# EAGLE design sparkfun-micromod-notecarrier (EAGLE 9.6.2)
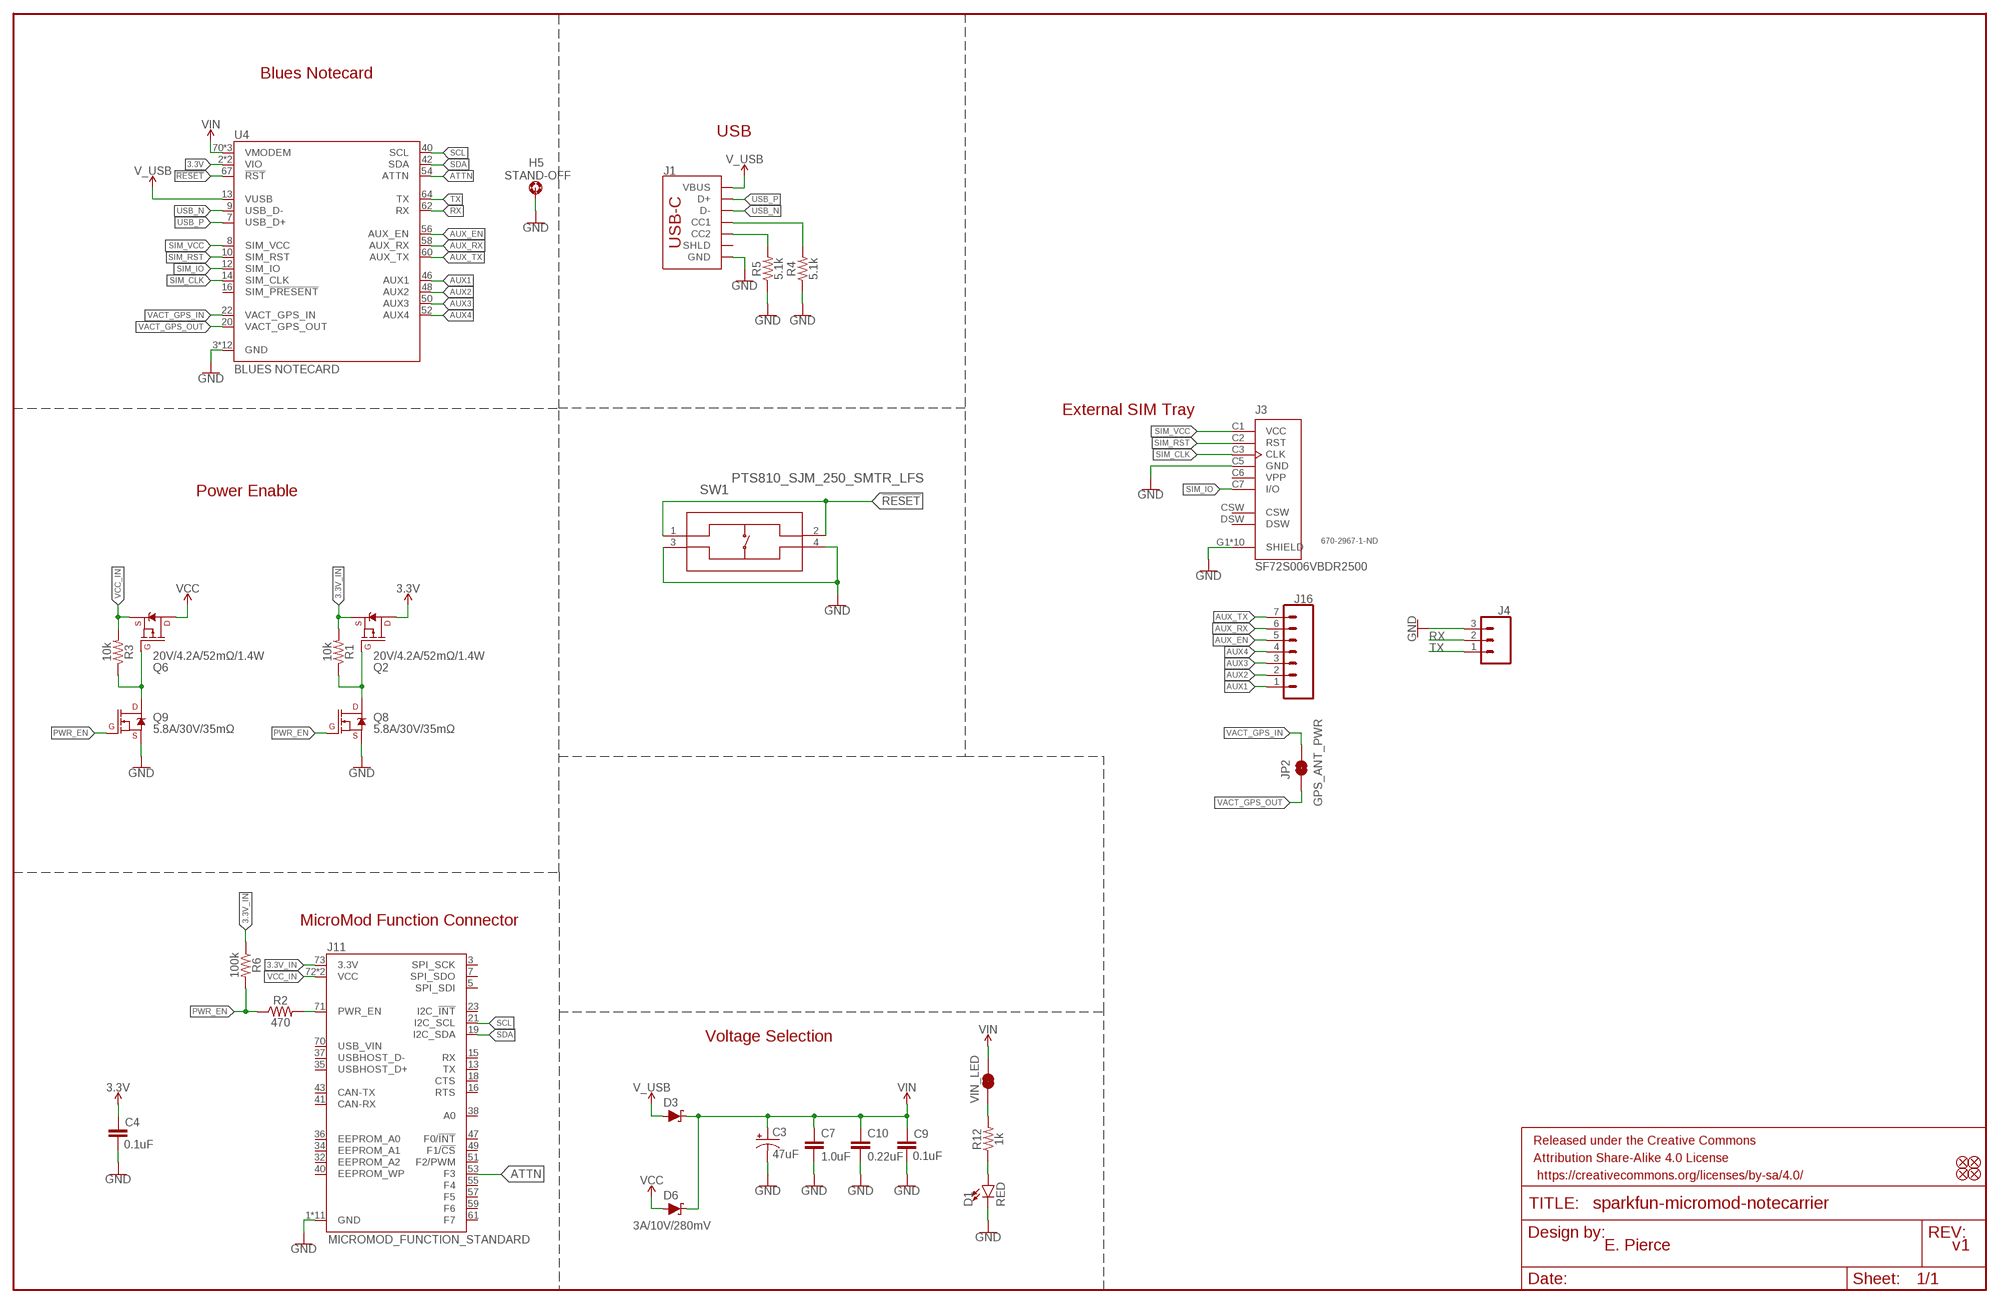
[diagram p0: schematic, sheet 1]

## Parts
C3  47uF  47UF-POLAR-EIA3528-10V-10%  [EIA3528]
C4  0.1uF  0.1UF-0603-25V-(+80/-20%)  [0603]
C7  1.0uF  1.0UF-0603-16V-10%  [0603]
C9  0.1uF  0.1UF-0603-25V-(+80/-20%)  [0603]
C10  0.22uF  0.22UF-0603-25V-10%  [0603]
D1  RED  LED-RED0603  [LED-0603]
D3  3A/10V/280mV  DIODE-SCHOTTKY-BAT60A  [SOD-323]
D6  3A/10V/280mV  DIODE-SCHOTTKY-BAT60A  [SOD-323]
FD1  FIDUCIALUFIDUCIAL  [FIDUCIAL-MICRO]
FD2  FIDUCIALUFIDUCIAL  [FIDUCIAL-MICRO]
FD3  FIDUCIALUFIDUCIAL  [FIDUCIAL-MICRO]
FD4  FIDUCIALUFIDUCIAL  [FIDUCIAL-MICRO]
FRAME1  FRAME-LEDGER  [CREATIVE_COMMONS]
H5  STAND-OFF  STAND-OFF-REFLOW2.5MM_TALL  [STAND-OFF-REFLOW-M2.5]
J1  USB_C_2-LAYER_PADS  [USB-C-16P-2LAYER-PADS]
J3  SF72S006VBDR2500  [JAE_SF72S006VBDR2500]
J4  CONN_031X03_NO_SILK  [1X03_NO_SILK]
J11  MICROMOD_FUNCTION_STANDARD  [M.2-CARD-E-22_FUNCTION_STANDARD]
J16  CONN_07NO_SILK  [1X07_NO_SILK]
JP2  GPS_ANT_PWR  JUMPER-SMT_2_NO_SILK  [SMT-JUMPER_2_NO_SILK]
Q2  20V/4.2A/52mΩ/1.4W  MOSFET_PCH-DMG2305UX-7  [SOT23-3]
Q6  20V/4.2A/52mΩ/1.4W  MOSFET_PCH-DMG2305UX-7  [SOT23-3]
Q8  5.8A/30V/35mΩ  MOSFET-NCH-AO3404A  [SOT23-3]
Q9  5.8A/30V/35mΩ  MOSFET-NCH-AO3404A  [SOT23-3]
R1  10k  10KOHM-0603-1/10W-1%  [0603@1]
R2  470  470OHM-0603-1/10W-1%  [0603@1]
R3  10k  10KOHM-0603-1/10W-1%  [0603@1]
R4  5.1k  5.1KOHM5.1KOHM-0603-1/10W-1%  [0603]
R5  5.1k  5.1KOHM5.1KOHM-0603-1/10W-1%  [0603]
R6  100k  100KOHM-0603-1/10W-1%  [0603@1]
R12  1k  1KOHM-0603-1/10W-1%  [0603]
SW1  PTS810_SJM_250_SMTR_LFS  [PTS810_CNK]
U4  BLUES NOTECARD  NOTECARD  [M.2-CONNECTOR-E]
VIN_LED  JUMPER-SMT_2_NC_TRACE_SILK  [SMT-JUMPER_2_NC_TRACE_SILK]

## Nets
3.3V: C4.1 Q2.3(D) U4.2(VIO) U4.4(VIO)
3.3V_IN: J11.73(3.3V) Q2.2(S) R1.2 R6.1
!RESET!: SW1.1 SW1.2 U4.67(!RST!)
ATTN: J11.53(F3) U4.54(ATTN)
AUX1: J16.1 U4.46(AUX1)
AUX2: J16.2 U4.48(AUX2)
AUX3: J16.3 U4.50(AUX3)
AUX4: J16.4 U4.52(AUX4)
AUX_EN: J16.5 U4.56(AUX_EN)
AUX_RX: J16.6 U4.58(AUX_RX)
AUX_TX: J16.7 U4.60(AUX_TX)
GND: C3.C(-) C4.2 C7.2 C9.2 C10.2 D1.C H5.1 J1.GND J1.GND2(GND) J3.C5(GND) J3.G1(SHIELD) J3.G2(SHIELD) J3.G3(SHIELD) J3.G4(SHIELD) J3.G5(SHIELD) J3.G6(SHIELD) J3.G7(SHIELD) J3.G8(SHIELD) J3.G9(SHIELD) J3.G10(SHIELD) J4.3 J11.1(GND) J11.33(GND) J11.39(GND) J11.45(GND) J11.75(GND) J11.GND1(GND) J11.GND2(GND) J11.GND3(GND) J11.GND4(GND) J11.GND5(GND) J11.GND6(GND) Q8.2(S) Q9.2(S) R4.1 R5.1 SW1.3 SW1.4 U4.3(GND) U4.5(GND) U4.6(GND) U4.11(GND) U4.18(GND) U4.33(GND) U4.39(GND) U4.45(GND) U4.51(GND) U4.57(GND) U4.71(GND) U4.73(GND)
N$2: Q2.1(G) Q8.3(D) R1.1
N$3: Q6.1(G) Q9.3(D) R3.1
N$4: J11.71(PWR_EN) R2.2
N$10: J1.A5(CC1) R4.2
N$11: J1.B5(CC2) R5.2
N$12: R12.2 VIN_LED.1
N$13: D1.A R12.1
PWR_EN: Q8.1(G) Q9.1(G) R2.1 R6.2
RX: J4.2 U4.62(RX)
SCL: J11.21(I2C_SCL) U4.40(SCL)
SDA: J11.19(I2C_SDA) U4.42(SDA)
SIM_CLK: J3.C3(CLK) U4.14(SIM_CLK)
SIM_IO: J3.C7(I/O) U4.12(SIM_IO)
SIM_RST: J3.C2(RST) U4.10(SIM_RST)
SIM_VCC: J3.C1(VCC) U4.8(SIM_VCC)
TX: J4.1 U4.64(TX)
USB_N: J1.A7(D-) J1.B7(D-) U4.9(USB_D-)
USB_P: J1.A6(D+) J1.B6(D+) U4.7(USB_D+)
V_USB: D3.A J1.VBUS1(VBUS) J1.VBUS2(VBUS) U4.13(VUSB)
VACT_GPS_IN: JP2.2 U4.22(VACT_GPS_IN)
VACT_GPS_OUT: JP2.1 U4.20(VACT_GPS_OUT)
VCC: D6.A Q6.3(D)
VCC_IN: J11.72(VCC) J11.74(VCC) Q6.2(S) R3.2
VIN: C3.A(+) C7.1 C9.1 C10.1 D3.C D6.C U4.70(VMODEM) U4.72(VMODEM) U4.74(VMODEM) VIN_LED.2
Unconnected: J1.SHLD1(SHLD) J1.SHLD2(SHLD) J1.SHLD3(SHLD) J1.SHLD4(SHLD) J3.CSW J3.DSW J11.3(SPI_SCK) J11.5(SPI_SDI) J11.7(SPI_SDO) J11.13(TX) J11.15(RX) J11.16(RTS) J11.18(CTS) J11.23(I2C_!INT!) J11.32(EEPROM_A2) J11.34(EEPROM_A1) J11.35(USBHOST_D+) J11.36(EEPROM_A0) J11.37(USBHOST_D-) J11.38(A0) J11.40(EEPROM_WP) J11.41(CAN-RX) J11.43(CAN-TX) J11.47(F0/!INT!) J11.49(F1/!CS!) J11.51(F2/PWM) J11.55(F4) J11.57(F5) J11.59(F6) J11.61(F7) J11.70(USB_VIN) U4.16(SIM_!PRESENT!)

## Notes on the sheet
- Blues Notecard
- USB
- External SIM Tray
- Power Enable
- 670-2967-1-ND
- MicroMod Function Connector
- Voltage Selection
- E. Pierce | v1

## Power pins joined to a net without a drawn wire
VPP: J3.C6(VPP)

## Library data of the parts
C3 = SparkFun-Capacitors:47UF-POLAR: 47µF polarized capacitors A capacitor is a passive two-terminal electrical component used to store electrical energy temporarily in an electric field.; PROD_ID: CAP-08310
C4 C9 = SparkFun-Capacitors:0.1UF: 0.1µF ceramic capacitors A capacitor is a passive two-terminal electrical component used to store electrical energy temporarily in an electric field.; PROD_ID: CAP-00810
C7 = SparkFun-Capacitors:1.0UF: 1µF ceramic capacitors A capacitor is a passive two-terminal electrical component used to store electrical energy temporarily in an electric field.; PROD_ID: CAP-00868
C10 = SparkFun-Capacitors:0.22UF: 0.22µF ceramic capacitors A capacitor is a passive two-terminal electrical component used to store electrical energy temporarily in an electric field.; PROD_ID: CAP-07822
D1 = SparkFun-LED:LED-RED: Red SMD LED Used in manufacturing of most products at SparkFun Packages: 0603 - SMD 0603 package [Product Link] <http://docs.avagotech.com/docs/AV02-0551EN> 0603 SMART - SMD 0603 SMART package ( more efficient and expensive)[Product Link] <http://www.osram-os.com/Graphics/XPic2/00077099_0.pdf> 1206 - SMD1206 package [Product Link] <https://www.sparkfun.com/datasheets/DevTools/LilyPad/Q150OVS4.pdff> SparkFun Products: Pro Mini 328 -5V <https://www.sparkfun.com/products/821> RedBoard <https://www.sparkfun.com/products/12757> IOIO-OTG <https://www.sparkfun.com/products/13613>; PROD_ID: DIO-00819
D3 D6 = SparkFun-DiscreteSemi:DIODE-SCHOTTKY: Schottky diode A Schottky diode is a semiconductor diode which has a low forward voltage drop and a very fast switching action.; PROD_ID: DIO-14072
FD1-FD4 = SparkFun-Aesthetics:FIDUCIAL: Fiducial Alignment Points Point-of-reference for pick-and-place machines and other optical instruments.
FRAME1 = SparkFun-Aesthetics:FRAME-LEDGER: Schematic Frame - Ledger Standard 11x14 US Ledger frame
H5 = SparkFun-Hardware:STAND-OFF-REFLOW: Stand Off Reflow Compatible A metal standoff that can be placed and reflowed onto a PCB.; PROD_ID: HW-14899
J1 = SparkFun-Connectors:USB_C: USB Type C 16Pin Connector Super Speed pins not available on the 16-pin purely SMD connector so this part is best for USB 2.0 implementations. D1 and D2 are tied together enabling D+/- no matter which way the cable is plugged into the connector. The two channel configuration pins (CC1/2) are exposed. These are normally connected to ground via 5.1k resistors but can be reconfigured for high current/high power applications. **4-LAYER BOARD WARNING!!** If designing 4-layer board, make sure to select the variant _4-LAYER-ISOLATED. The linked footprint (USB-C-16-4LAYER-ISOLATED) includes some very necessary cutout polygons in the inner layers (2 and 15). This prevents the PTH mounting shield legs on the USB connector from electrically connecting any other polygons on the inner layers (usually VCC and GND).; PROD_ID: CONN-14122
J3 = SF72S006VBDR2500:SF72S006VBDR2500; DESCRIPTION: 8 (6 + 2) Position Card Connector NANO SIM Surface Mount, Right Angle Gold; DIGI-KEY_PART_NUMBER: 670-2967-2-ND; MF: JAE Electronics; MP: SF72S006VBDR2500; PACKAGE: None; PURCHASE-URL: https://pricing.snapeda.com/search/part/SF72S006VBDR2500/?ref=eda
J4 = SparkFun-Connectors:CONN_03: Multi connection point. Often used as Generic Header-pin footprint for 0.1 inch spaced/style header connections On any of the 0.1 inch spaced packages, you can populate with these: Break Away Headers - Straight <https://www.sparkfun.com/products/116> (PRT-00116) Break Away Male Headers - Right Angle <https://www.sparkfun.com/products/553> (PRT-00553) Female Headers <https://www.sparkfun.com/products/115> (PRT-00115) Break Away Headers - Machine Pin <https://www.sparkfun.com/products/117> (PRT-00117) Break Away Female Headers - Swiss Machine Pin <https://www.sparkfun.com/products/743> (PRT-00743) Stackable Header - 3 Pin (Female, 0.1") <https://www.sparkfun.com/products/13875> (PRT-13875) For SCREWTERMINALS and SPRING TERMINALS visit here: Screw Terimnals on SparkFun.com <https://www.sparkfun.com/search/results?term=Screw+Terminals> (5mm/3.5mm/2.54mm spacing) This device is also useful as a general connection point to wire up your design to another part of your project. Our various solder wires solder well into these plated through hole pads. Hook-Up Wire - Assortment (Stranded, 22 AWG) <https://www.sparkfun.com/products/11375> (PRT-11375) Hook-Up Wire - Assortment (Solid Core, 22 AWG) <https://www.sparkfun.com/products/11367> (PRT-11367) View the entire wire category on our website here <https://www.sparkfun.com/categories/141> Special notes: Molex polarized connector foot print use with SKU : PRT-08232 with associated crimp pins and housings.
J11 = SparkFun-MicroMod:MICROMOD_FUNCTION: MicroMod Connector Description: A card edge connector and mating PCB connector to allow various MicroMod Processor Boards to be coupled with various carrier boards of different capabilities. Based on the M.2 standard.
J16 = SparkFun-Connectors:CONN_07: Multi connection point. Often used as Generic Header-pin footprint for 0.1 inch spaced/style header connections On any of the 0.1 inch spaced packages, you can populate with these: Break Away Headers - Straight <https://www.sparkfun.com/products/116> (PRT-00116) Break Away Male Headers - Right Angle <https://www.sparkfun.com/products/553> (PRT-00553) Female Headers <https://www.sparkfun.com/products/115> (PRT-00115) Break Away Headers - Machine Pin <https://www.sparkfun.com/products/117> (PRT-00117) Break Away Female Headers - Swiss Machine Pin <https://www.sparkfun.com/products/743> (PRT-00743) For SCREWTERMINALS and SPRING TERMINALS visit here: Screw Terimnals on SparkFun.com <https://www.sparkfun.com/search/results?term=Screw+Terminals> (5mm/3.5mm/2.54mm spacing) This device is also useful as a general connection point to wire up your design to another part of your project. Our various solder wires solder well into these plated through hole pads. Hook-Up Wire - Assortment (Stranded, 22 AWG) <https://www.sparkfun.com/products/11375> (PRT-11375) Hook-Up Wire - Assortment (Solid Core, 22 AWG) <https://www.sparkfun.com/products/11367> (PRT-11367) View the entire wire category on our website here <https://www.sparkfun.com/categories/141> Special notes: Molex polarized connector foot print use with SKU : PRT-08231 with associated crimp pins and housings. 1MM SMD Version SKU: PRT-10208 NOTES ON THE VARIANTS LOCK and LOCK_LONGPADS... This footprint was designed to help hold the alignment of a through-hole component (i.e. 6-pin header) while soldering it into place. You may notice that each hole has been shifted either up or down by 0.005 of an inch from it's more standard position (which is a perfectly straight line). This slight alteration caused the pins (the squares in the middle) to touch the edges of the holes. Because they are alternating, it causes a "brace" to hold the component in place. 0.005 has proven to be the perfect amount of "off-center" position when using our standard breakaway headers. Although looks a little odd when you look at the bare footprint, once you have a header in there, the alteration is very hard to notice. Also,if you push a header all the way into place, it is covered up entirely on the bottom side.
JP2 = SparkFun-Jumpers:JUMPER-SMT_2_NO: Normally open jumper This jumper has two pads in close proximity to each other. Apply solder to close the connection. Round pads are easier to solder for beginners, but are a lot larger. SparkFun Product that uses the round pads: SparkFun EL Sequencer <https://www.sparkfun.com/products/12781>
Q2 Q6 = SparkFun-DiscreteSemi:MOSFET_PCH: P-channel MOSFETs Voltage controlled devices that allow control of high current outputs. SparkFun Products: SparkFun ESP32 Thing <https://www.sparkfun.com/products/13907> SparkFun ESP8266 Thing <https://www.sparkfun.com/products/13231> SparkFun Pi Servo HAT V2 <https://www.sparkfun.com/products/15316> DMG2305UX-7 (20V/4.2A/SOT23-3); PROD_ID: TRANS-14388
Q8 Q9 = SparkFun-DiscreteSemi:MOSFET-NCH: N-channel MOSFETs Voltage controlled devices that allow control of high current outputs. SparkFun Products: SparkFun OpenScale <https://www.sparkfun.com/products/13261> SparkFun Digital Sandbox <https://www.sparkfun.com/products/12651> SparkFun Monster Moto Shield <https://www.sparkfun.com/products/10182> SparkFun MOSFET Power Controller <https://www.sparkfun.com/products/11214>; PROD_ID: TRANS-12988
R1 R3 = SparkFun-Resistors:10KOHM: 10kΩ resistor A resistor is a passive two-terminal electrical component that implements electrical resistance as a circuit element. Resistors act to reduce current flow, and, at the same time, act to lower voltage levels within circuits. - Wikipedia; PROD_ID: RES-00824
R2 = SparkFun-Resistors:470OHM: 470Ω resistor A resistor is a passive two-terminal electrical component that implements electrical resistance as a circuit element. Resistors act to reduce current flow, and, at the same time, act to lower voltage levels within circuits. - Wikipedia; PROD_ID: RES-07869
R4 R5 = SparkFun-Resistors:5.1KOHM; PROD_ID: RES-12083
R6 = SparkFun-Resistors:100KOHM: 100kΩ resistor A resistor is a passive two-terminal electrical component that implements electrical resistance as a circuit element. Resistors act to reduce current flow, and, at the same time, act to lower voltage levels within circuits. - Wikipedia; PROD_ID: RES-07828
R12 = SparkFun-Resistors:1KOHM: 1kΩ resistor A resistor is a passive two-terminal electrical component that implements electrical resistance as a circuit element. Resistors act to reduce current flow, and, at the same time, act to lower voltage levels within circuits. - Wikipedia; PROD_ID: RES-07856
SW1 = PTS810-SJM-250-button:PTS810_SJM_250_SMTR_LFS; COPYRIGHT: Copyright (C) 2022 Ultra Librarian. All rights reserved.; DIGI-KEY_PART_NUMBER_1: CKN10502TR-ND; DIGI-KEY_PART_NUMBER_2: CKN10502CT-ND; DIGI-KEY_PART_NUMBER_3: CKN10502DKR-ND; MANUFACTURER_PART_NUMBER: PTS810 SJM 250 SMTR LFS; MFR_NAME: C&K
U4 = Notecard:NOTECARD
VIN_LED = SparkFun-Jumpers:JUMPER-SMT_2_NC_TRACE: Normally closed trace jumper This jumper has a trace between two pads so it's normally closed (NC). Use a razor knife to open the connection. For best results follow the IPC guidelines for cutting traces: Cutout at least 0.063 mm (0.005 in). Remove all loose material to clean up the cut area. Seal the cut with an approved epoxy. Reapply solder to reclose the connection.

## Net classes
0 default: width 0 mm, drill 0 mm
1 vcc: width 0 mm

## Board
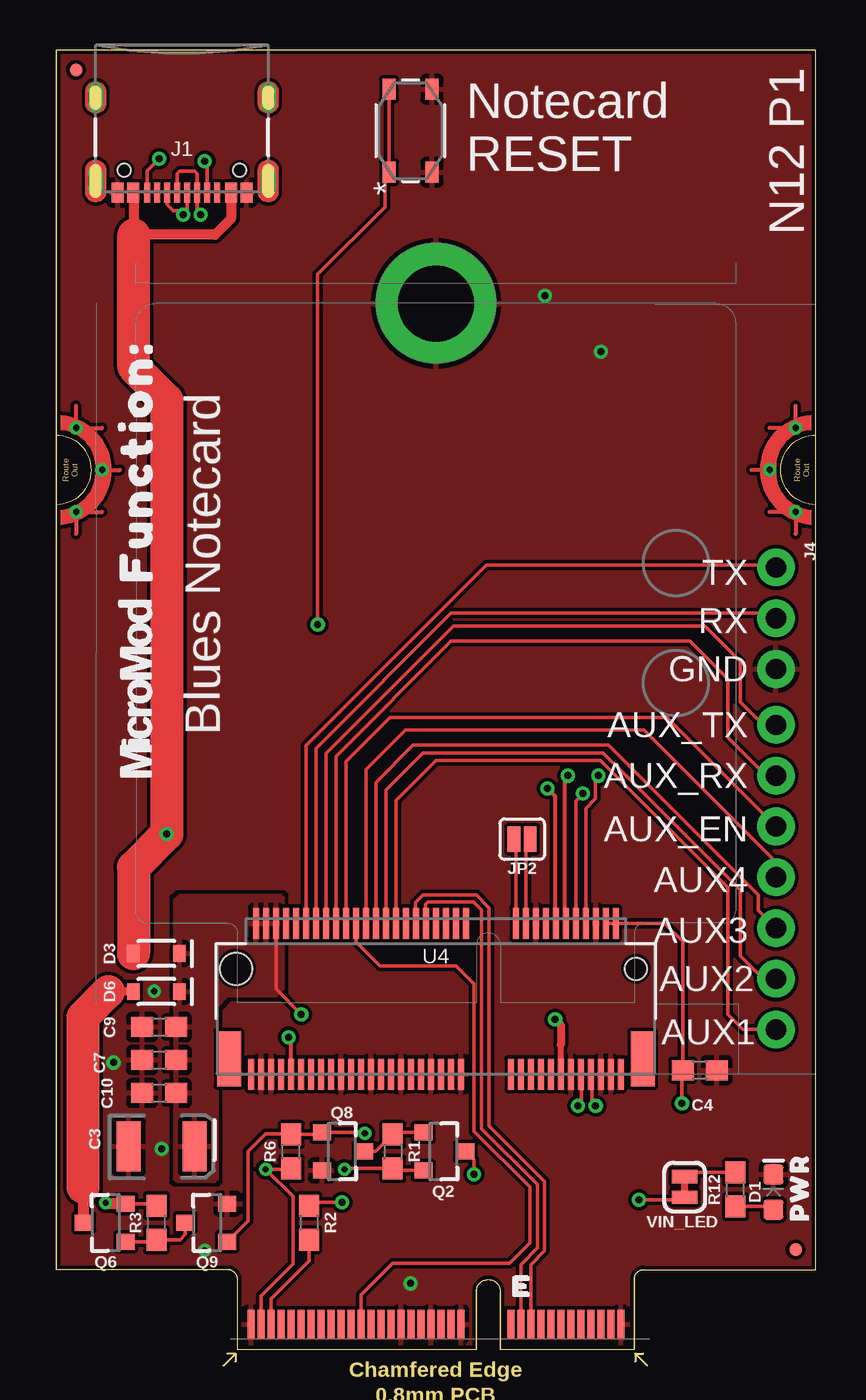
[diagram p1: board, top side]
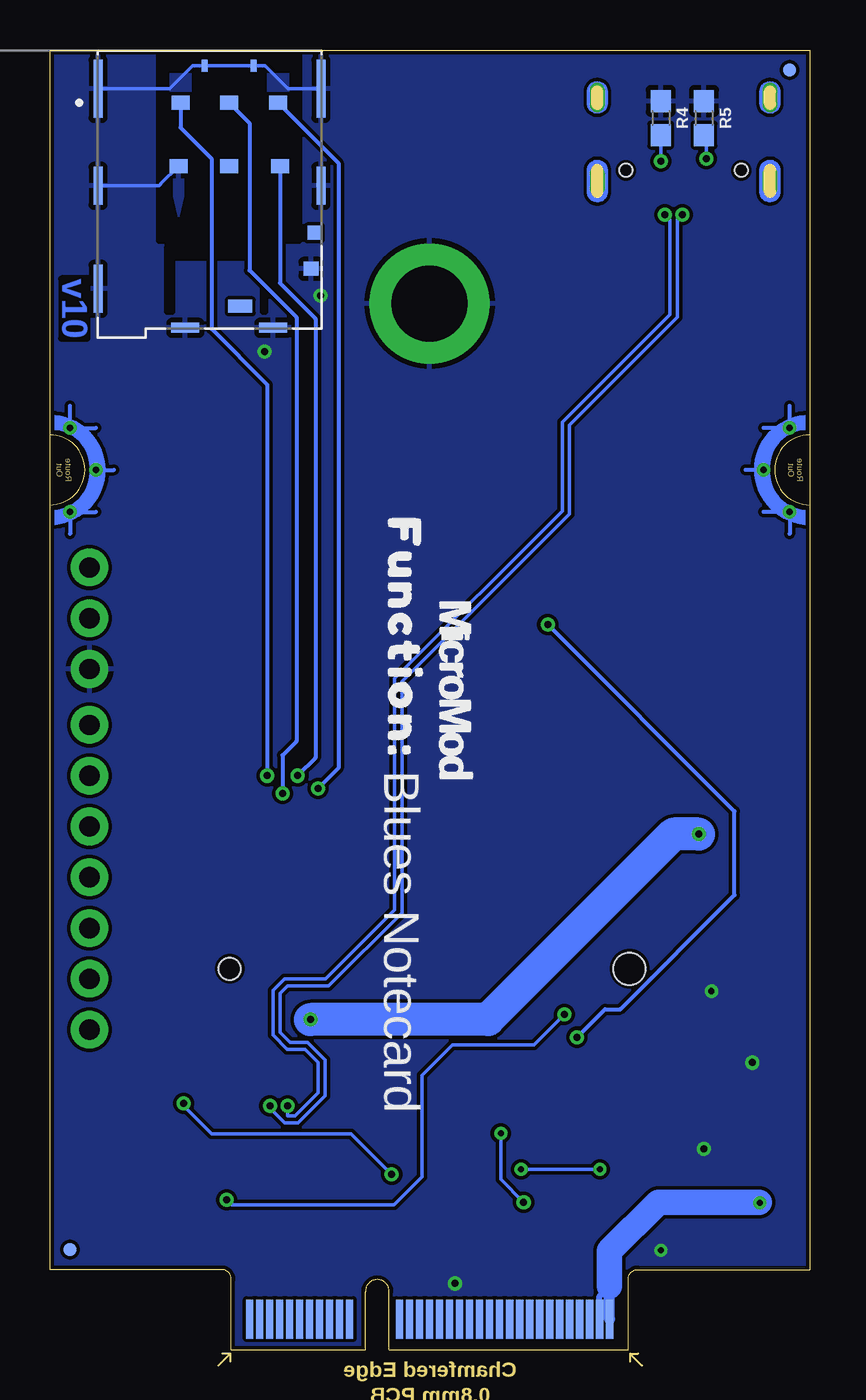
[diagram p2: board, bottom side, seen from below]

Size 38 x 65 mm. Coordinates in mm from the lower left corner, seen from the top.
Outline: 28.93,0 22.22,0 22.22,2.9 arc180 21.02,2.9 21.02,0 9.07,0 9.07,3.5 arc90 8.6,4 0,4 0,65 38,65 38,4 29.4,4 arc90 28.93,3.5 28.93,0
Copper layers (1*16): Top/Horz 0.035mm / dielectric 1.5mm / Bottom/Vert 0.035mm
Design rules "SparkFun-2-layer-TIGHT *": minimum track width 7mil, minimum drill 12mil, track to track 7mil, track to pad 7mil, pad to pad 7mil, via to via 7mil, smd to smd 7mil, copper to edge 7mil, drill to drill 7mil, minimum pad ring 7mil, minimum via ring 7mil, stop-mask expansion 4mil, vias tented up to drill 25mil, thermal gap 10mil

### Footprints (pad centres in the part's own frame; a part is rotated, then mirrored left to right if it is on the bottom)
EIA3528 = smd 1.2 x 2.5: A 1.65,0; C -1.65,0
0603 = smd 1.1 x 1: 1 -0.85,0; 2 0.85,0
LED-0603 = smd 1 x 1: A -0.877,0; C 0.877,0
SOD-323 = smd 0.63 x 0.83: A 1.15,0; C -1.15,0
FIDUCIAL-MICRO = smd 0.635 x 0.635: 1 0,0
STAND-OFF-REFLOW-M2.5 = drill 3.8 pad 6: 1 0,0
USB-C-16P-2LAYER-PADS = smd 0.3 x 1: A5 -1.25,-0.34; A6 -0.25,-0.34; A7 0.25,-0.34; A8 1.25,-0.34; B5 1.75,-0.34; B6 0.75,-0.34; B7 -0.75,-0.34; B8 -1.75,-0.34 | smd 0.6 x 1: GND -3.225,-0.34; GND2 3.225,-0.34; VBUS1 -2.45,-0.34; VBUS2 2.45,-0.34 | drill 0.4 pad 0.6 long: SHLD1 -4.318,-0.915; SHLD2 4.318,-0.915; SHLD3 -4.318,-5.095; SHLD4 4.318,-5.095 | hole 0.65: -2.89,-1.445; 2.89,-1.445
JAE_SF72S006VBDR2500 = smd 0.9 x 0.7: C1 2.44,-4.575; C2 0,-4.575; C3 -2.44,-4.575; C5 2.54,-1.405; C6 0,-1.405; C7 -2.54,-1.405 | smd 0.7 x 0.7: CSW -4.27,1.925 | smd 1.2 x 0.65: DSW -0.55,5.6 | smd 0.45 x 2.9: G1 -4.595,-5.275; G8 6.555,-5.275 | smd 0.45 x 1.9: G2 -4.595,-0.425; G7 6.555,-0.425 | smd 0.75 x 0.7: G3 -4.095,3.725 | smd 1.4 x 0.5: G4 -2.2,6.675; G5 2.2,6.675 | smd 0.45 x 2.4: G6 6.555,4.725 | smd 0.3 x 0.6: G9 1.22,-6.425; G10 -1.22,-6.425
1X03_NO_SILK = drill 1.016 pad 1.88: 1 0,0; 2 2.54,0; 3 5.08,0
M.2-CARD-E-22_FUNCTION_STANDARD = smd 0.35 x 1.45: 1 9.25,1.275; 3 8.75,1.275; 5 8.25,1.275; 7 7.75,1.275; 9 7.25,1.275; 11 6.75,1.275; 13 6.25,1.275; 15 5.75,1.275; 17 5.25,1.275; 19 4.75,1.275; 21 4.25,1.275; 23 3.75,1.275; 33 1.25,1.275; 35 0.75,1.275; 37 0.25,1.275; 39 -0.25,1.275; 41 -0.75,1.275; 43 -1.25,1.275; 45 -1.75,1.275; 47 -2.25,1.275; 49 -2.75,1.275; 51 -3.25,1.275; 53 -3.75,1.275; 55 -4.25,1.275; 57 -4.75,1.275; 59 -5.25,1.275; 61 -5.75,1.275; 63 -6.25,1.275; 65 -6.75,1.275; 67 -7.25,1.275; 69 -7.75,1.275; 71 -8.25,1.275; 73 -8.75,1.275; 75 -9.25,1.275 | smd 0.35 x 1.95 bottom: 2 9,1.525; 4 8.5,1.525; 6 8,1.525; 8 7.5,1.525; 10 7,1.525; 12 6.5,1.525; 14 6,1.525; 16 5.5,1.525; 18 5,1.525; 20 4.5,1.525; 22 4,1.525; 32 1.5,1.525; 34 1,1.525; 36 0.5,1.525; 38 0,1.525; 40 -0.5,1.525; 42 -1,1.525; 44 -1.5,1.525; 46 -2,1.525; 48 -2.5,1.525; 50 -3,1.525; 52 -3.5,1.525; 54 -4,1.525; 56 -4.5,1.525; 58 -5,1.525; 60 -5.5,1.525; 62 -6,1.525; 64 -6.5,1.525; 66 -7,1.525; 68 -7.5,1.525; 70 -8,1.525; 72 -8.5,1.525; 74 -9,1.525 | drill 0.305 pad 0.61: GND1 -18,41.9; GND2 -16.7,44; GND3 -18,46.1; GND4 18,41.9; GND5 16.7,44; GND6 18,46.1
1X07_NO_SILK = drill 1.016 pad 1.88: 1 0,0; 2 2.54,0; 3 5.08,0; 4 7.62,0; 5 10.16,0; 6 12.7,0; 7 15.24,0
SMT-JUMPER_2_NO_SILK = smd 0.635 x 1.27: 1 -0.406,0; 2 0.406,0
SOT23-3 = smd 0.8 x 0.9: 1 -0.95,-1; 2 0.95,-1; 3 0,1.1
0603@1 = smd 1.1 x 1: 1 -0.85,0; 2 0.85,0
PTS810_CNK = smd 1.041 x 0.66: 1 -2.075,1.075; 2 2.075,1.075; 3 -2.075,-1.075; 4 2.075,-1.075
M.2-CONNECTOR-E = smd 0.3 x 1.55: 1 9.25,-5.275; 2 9,2.275; 3 8.75,-5.275; 4 8.5,2.275; 5 8.25,-5.275; 6 8,2.275; 7 7.75,-5.275; 8 7.5,2.275; 9 7.25,-5.275; 10 7,2.275; 11 6.75,-5.275; 12 6.5,2.275; 13 6.25,-5.275; 14 6,2.275; 15 5.75,-5.275; 16 5.5,2.275; 17 5.25,-5.275; 18 5,2.275; 19 4.75,-5.275; 20 4.5,2.275; 21 4.25,-5.275; 22 4,2.275; 23 3.75,-5.275; 32 1.5,2.275; 33 1.25,-5.275; 34 1,2.275; 35 0.75,-5.275; 36 0.5,2.275; 37 0.25,-5.275; 38 0,2.275; 39 -0.25,-5.275; 40 -0.5,2.275; 41 -0.75,-5.275; 42 -1,2.275; 43 -1.25,-5.275; 44 -1.5,2.275; 45 -1.75,-5.275; 46 -2,2.275; 47 -2.25,-5.275; 48 -2.5,2.275; 49 -2.75,-5.275; 50 -3,2.275; 51 -3.25,-5.275; 52 -3.5,2.275; 53 -3.75,-5.275; 54 -4,2.275; 55 -4.25,-5.275; 56 -4.5,2.275; 57 -4.75,-5.275; 58 -5,2.275; 59 -5.25,-5.275; 60 -5.5,2.275; 61 -5.75,-5.275; 62 -6,2.275; 63 -6.25,-5.275; 64 -6.5,2.275; 65 -6.75,-5.275; 66 -7,2.275; 67 -7.25,-5.275; 68 -7.5,2.275; 69 -7.75,-5.275; 70 -8,2.275; 71 -8.25,-5.275; 72 -8.5,2.275; 73 -8.75,-5.275; 74 -9,2.275; 75 -9.25,-5.275 | smd 1.2 x 2.75: A1 10.35,-4.5; A2 -10.35,-4.5 | hole 1.1: 10,0 | hole 1.6: -10,0
SMT-JUMPER_2_NC_TRACE_SILK = smd 0.66 x 1.27: 1 -0.521,0; 2 0.521,0

### Placement (x,y rotation side)
C3  5.28,10.16 0 top
C4  32.21,13.97 0 top
C7  5.16,14.48 180 top
C9  5.16,16.13 180 top
C10  5.16,12.83 180 top
D1  35.89,7.87 90 top
D3  5.03,19.81 180 top
D6  5.03,17.91 180 top
FD1  37,5 90 top
FD2  1,64 90 top
FD3  37,5 270 bottom
FD4  1,64 270 bottom
FRAME1  12.65,-13.97 0 top  (outside the outline)
H5  19,52.32 0 top
J1  6.3,57.53 180 top
J3  29.03,57.78 180 bottom
J4  36.02,39.12 270 top
J11  19,0 0 top
J16  36.02,16 90 top
JP2  23.32,25.53 180 top
LOGO2  SPECIAL_INSTRUCTIONS-ORDERING  [ORDERING_INSTRUCTIONS]  55.83,59.69 0 top  (outside the outline)
Q2  19.38,9.91 270 top
Q6  2.49,6.35 90 top
Q8  14.3,9.91 270 top
Q9  7.57,6.35 90 top
R1  16.84,9.91 270 top
R2  12.65,6.35 270 top
R3  5.03,6.35 90 top
R4  7.44,61.59 270 bottom
R5  5.28,61.59 270 bottom
R6  11.76,9.91 90 top
R12  33.99,8 90 top
SW1  17.73,60.96 90 top
U4  19,19.05 0 top
U$4  [FUNCTION#0]  20.27,35.56 270 bottom
U$7  [PWR0]  37.2,8.1 90 top
U$8  [FUNCTION#0]  4.01,44.45 90 top
U$37  [MICROMOD_LOGO_.35]  17.73,33.02 270 bottom
U$63  [MICROMOD_LOGO_.35]  4,33 90 top
VIN_LED  31.45,8.13 270 top

### Tracks (layer width: path | path; a pad name or v marks a point on that pad's centre or on a via)
3.3V  (via drill 0.35)
  Top/Horz 0.178: Q2.3 20.9,9.48 v20.9,8.76 | v31.32,12.32 31.32,13.93 C4.1 31.36,20.41 30.44,21.32 U4.2 U4.4
  Bottom/Vert 0.178: v20.9,8.76 22.94,10.79 29.92,10.79 31.32,12.19 v31.32,12.32
3.3V_IN  (via drill 0.3)
  Top/Horz 0.178: J11.73 10.25,2.68 11.85,4.28 11.85,7.66 v10.49,9.02 11.72,9.02 R6.1 | v14.43,9.02 14.47,9.06 16.71,9.06 | 16.71,9.06 R1.2 | Q2.2 16.81,8.96 16.71,9.06
  Bottom/Vert 0.178: v14.43,9.02 v10.49,9.02
!RESET!  (via drill 0.35)
  Top/Horz 0.178: v13.09,36.26 13.09,53.78 16.46,57.15 16.46,58.69 SW1.1 SW1.2
  Top/Horz 0.203: U4.67 11.75,15.51 v11.63,15.62
  Bottom/Vert 0.203: v11.63,15.62 10.24,17.02 9.47,17.02 3.76,22.73 3.76,26.92 v13.09,36.26
ATTN
  Top/Horz 0.178: U4.54 15,20.38 16.21,19.18 20.02,19.18 20.9,18.29 20.9,10.92 23.7,8.13 23.7,5.33 22.68,4.32 16.84,4.32 15.25,2.73 J11.53
AUX1
  Top/Horz 0.178: U4.46 17,27.46 19,29.46 27.24,29.46 33.61,23.1 33.61,16.76 34.37,16 J16.1
AUX2
  Top/Horz 0.178: U4.48 16.5,27.98 18.36,29.84 27.36,29.84 28.36,28.85 28.36,28.87 34.24,22.99 34.24,19.68 35.38,18.54 J16.2
AUX3
  Top/Horz 0.178: U4.50 16,28.37 17.86,30.23 27.64,30.23 35.13,22.73 35.13,21.97 J16.3
AUX4
  Top/Horz 0.178: U4.52 15.5,29.01 17.48,30.99 29.41,30.99 36.02,24.38 J16.4
AUX_EN
  Top/Horz 0.178: U4.56 14.5,29.41 16.71,31.62 30.56,31.62 J16.5
AUX_RX
  Top/Horz 0.178: U4.58 14,29.67 19.76,35.43 31.7,35.43 33.61,33.53 33.61,30.61 35.51,28.7 J16.6
AUX_TX
  Top/Horz 0.178: U4.60 13.5,29.81 19.89,36.2 32.46,36.2 34.24,34.42 34.24,32.38 35.38,31.24 J16.7
GND  (via drill 0.3, 0.35)
  Top/Horz 0.254: J11.GND4 35.7,43.2 J11.GND5 | J11.GND1 2.3,43.2 J11.GND2
  Bottom/Vert 0.178: J3.G1 26.09,63.06 27.24,64.21 J3.G10 J3.G9 30.86,64.21 32.01,63.06 J3.G8 | J3.C5 32.46,58.3 32.46,58.29 32.55,58.21 J3.G7
  other vias: 4.9,17.92 7.44,4.97 5.28,10.03 2.87,14.35 17.73,3.3 24.46,52.7 27.25,49.91
  pour Bottom/Vert (isolate 0.152): 0,0 0,65 38,65 38,0
  pour Top/Horz (isolate 0.152, rank 6): 0,0 0,65 38,65 38,0
N$2
  Top/Horz 0.178: Q2.1 16.94,10.86 R1.1 15.99,9.91 Q8.3
N$3
  Top/Horz 0.178: Q6.1 4.93,5.4 R3.1 6.21,5.5 6.47,5.76 Q9.3
N$4
  Top/Horz 0.178: J11.71 10.75,2.54 12.65,4.45 R2.2
N$10  (via drill 0.35)
  Top/Horz 0.178: J1.A5 7.55,59.33 v7.44,59.44
  Bottom/Vert 0.178: v7.44,59.44 R4.2
N$11  (via drill 0.35)
  Top/Horz 0.178: J1.B5 4.55,58.96 v5.16,59.56
  Bottom/Vert 0.178: v5.16,59.56 5.16,60.62 R5.2
N$12
  Top/Horz 0.178: VIN_LED.1 31.65,8.85 R12.2
N$13
  Top/Horz 0.178: R12.1 35.74,7.15 D1.A
PWR_EN  (via drill 0.3, 0.35)
  Top/Horz 0.178: v15.44,10.81 15.4,10.86 Q8.1 13.2,10.76 R6.2 11.72,10.79 10.49,10.79 9.6,9.91 9.6,6.43 Q9.1 | R2.1 12.82,7.37 v14.3,7.37
  Bottom/Vert 0.178: v14.3,7.37 15.44,8.51 v15.44,10.81
RX
  Top/Horz 0.178: U4.62 13,30.07 19.76,36.83 35.89,36.83 J4.2
SCL
  Top/Horz 0.178: J11.21 23.25,4.25 24.08,5.08 24.08,8.26 21.29,11.05 21.29,21.98 20.88,22.38 18.62,22.38 18.49,22.25 U4.40
SDA
  Top/Horz 0.178: J11.19 23.75,4.25 24.44,4.93 24.44,8.41 21.67,11.18 21.67,22.1 21.03,22.73 18.36,22.73 17.98,22.35 17.98,21.34 U4.42
SIM_CLK  (via drill 0.35)
  Top/Horz 0.203: v24.59,28.07 24.97,27.69 24.97,21.36 U4.14
  Bottom/Vert 0.203: J3.C3 23.57,59.34 23.57,29.08 v24.59,28.07
SIM_IO  (via drill 0.35)
  Top/Horz 0.203: v25.6,28.7 25.44,28.54 25.44,21.38 U4.12
  Bottom/Vert 0.203: J3.C7 26.49,53.34 24.71,51.56 24.71,29.59 v25.6,28.7
SIM_RST  (via drill 0.35)
  Top/Horz 0.178: U4.10 26,27.45 v26.37,27.81
  Bottom/Vert 0.203: J3.C2 28.02,61.34 28.02,53.98 25.67,51.63 25.67,30.42 26.37,29.72 v26.37,27.81
SIM_VCC  (via drill 0.35)
  Top/Horz 0.178: U4.8 26.5,25.65 26.5,27.07 26.98,27.56 26.98,28.56 v27.13,28.7
  Bottom/Vert 0.203: J3.C1 31.47,61.11 29.92,59.56 29.92,51.05 27.13,48.26 v27.13,28.7
TX
  Top/Horz 0.178: U4.64 12.5,30.2 21.54,39.24 36.02,39.24 J4.1
USB_N  (via drill 0.35)
  Top/Horz 0.178: J1.A7 6.05,58.8 6.17,58.93 6.94,58.93 7.06,58.8 7.06,57.88 J1.B7 7.05,56.96 v7.24,56.77 | v26.11,12.19 26.29,12.37 26.29,13.73 U4.9
  Bottom/Vert 0.178: v7.24,56.77 6.98,56.51 6.98,51.77 12.37,46.38 12.37,41.94 20.75,33.55 20.75,22 24.21,18.54 26.26,18.54 26.85,17.95 26.85,15.73 26.13,15.01 25.25,15.01 24.59,14.35 24.59,12.83 25.73,11.68 26.11,11.68 v26.11,12.19
USB_P  (via drill 0.35)
  Top/Horz 0.178: J1.B6 5.55,57.27 5.86,56.96 6.17,56.96 v6.36,56.77 6.55,56.96 J1.A6 | v27,12.19 26.82,12.37 26.82,13.71 U4.7
  Bottom/Vert 0.178: v6.36,56.77 6.62,56.51 6.62,51.63 12.01,46.23 12.01,41.79 20.4,33.41 20.4,21.85 24.06,18.19 26.11,18.19 26.49,17.8 26.49,15.88 25.98,15.37 25.1,15.37 24.23,14.5 24.23,12.68 25.58,11.33 26.26,11.33 27,12.06 v27,12.19
V_USB  (via drill 0.35)
  Top/Horz 0.305: U4.13 25.25,15.24
  Top/Horz 0.406: v24.97,16.51 25.25,16.23 25.25,15.24
  Top/Horz 0.508: J1.VBUS2 3.89,57.83 3.89,55.75 7.95,55.75 8.75,56.55 J1.VBUS1
  Top/Horz 1.651: D3.A 3.88,24.12 v5.54,25.78 5.54,47.5 3.89,49.15 3.89,55.75
  Bottom/Vert 1.651: v5.54,25.78 6.81,25.78 16.08,16.51 v24.97,16.51
VACT_GPS_IN
  Top/Horz 0.178: U4.22 23,25.44 JP2.2
VACT_GPS_OUT
  Top/Horz 0.178: U4.20 23.5,25.3 JP2.1
VCC
  Top/Horz 0.406: D6.A 2.62,17.91
  Top/Horz 0.559: 1.35,8.13 1.35,6.39 Q6.3
  Top/Horz 1.651: 1.35,8.13 1.35,16.64 2.62,17.91
VCC_IN  (via drill 0.3)
  Top/Horz 0.178: R3.2 4.93,7.3 Q6.2
  Top/Horz 0.559: Q6.2 2.53,7.3 v2.49,7.34
  Bottom/Vert 0.305: J11.72 10.5,2.67 10,3.17
  Bottom/Vert 0.559: 2.52,7.37 v2.49,7.34 | J11.74 10,3.17
  Bottom/Vert 1.27: 2.52,7.37 7.57,7.37 10,4.94 10,3.17
VIN  (via drill 0.35)
  Top/Horz 0.178: U4.70 11,18.03 v12.27,16.76 | v29.16,7.49 31.33,7.49 VIN_LED.2
  Bottom/Vert 0.178: v12.27,16.76 13.79,15.24 17.86,15.24 19.38,13.72 19.38,8.64 20.78,7.24 28.91,7.24 v29.16,7.49
  pour Top/Horz: 5.92,22.48 5.92,8.51 6.05,8.38 7.95,8.38 8.08,8.51 8.08,17.14 8.59,17.65 11,17.65 11.38,18.03 11.38,22.61 11.25,22.73 6.17,22.73

### Text on the board
Bottom/Vert: v10
tPlace: Notecard / RESET | N12 P1 | TX | RX | GND | AUX_TX | Blues Notecard | AUX_RX | AUX_EN | AUX4 | AUX3 | AUX2 | AUX1
bPlace: Blues Notecard
tDocu: Board Thickness is 0.8mm | 2-Layer | Beveled Edge | ENIG Finish | E. Pierce